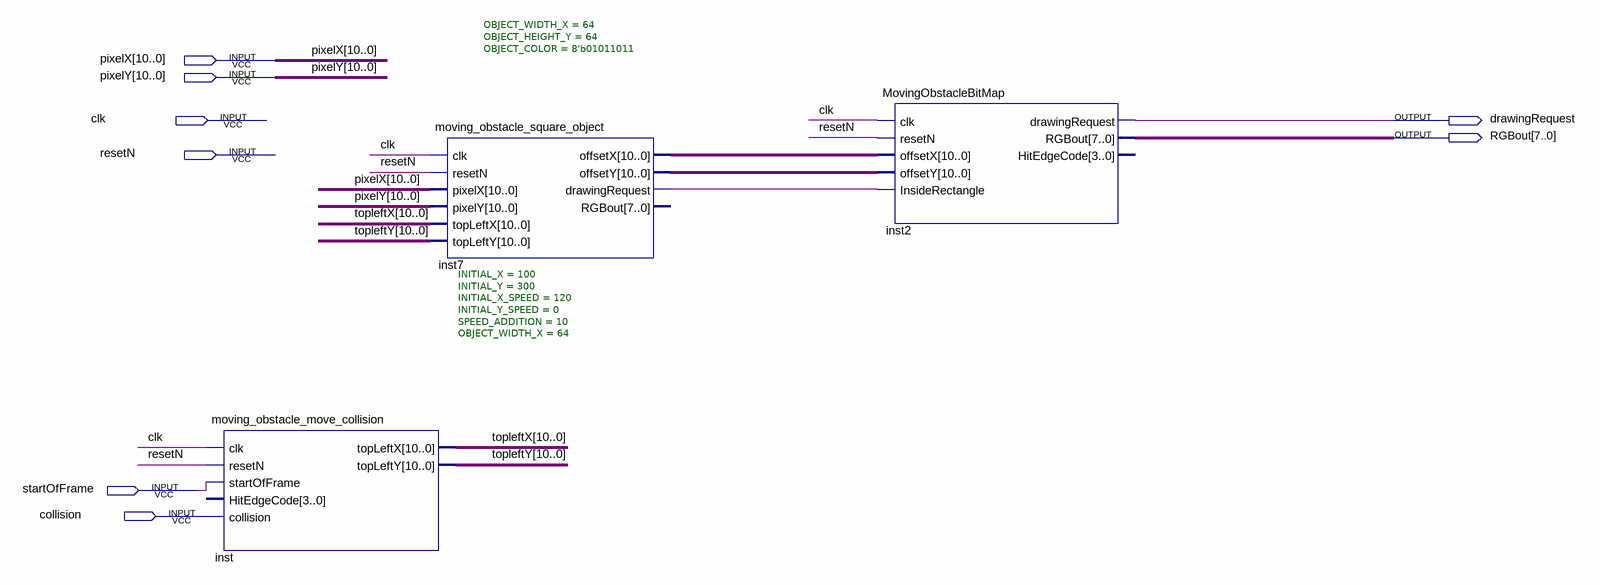
[diagram p0: schematic sheet]
// Quartus schematic moving_obstacle_block.bdf as structural Verilog: 3 symbols, 8 pins
module moving_obstacle_block (
  input  [10:0] pixelX,
  input  [10:0] pixelY,
  input  clk,
  input  resetN,
  input  startOfFrame,
  input  collision,
  output drawingRequest,
  output [7:0] RGBout
);

  wire inst7_drawingrequest;
  wire [10:0] inst7_offsetx, inst7_offsety, topleftX, topleftY;

  moving_obstacle_move_collision #(.INITIAL_X(100), .INITIAL_Y(300), .INITIAL_X_SPEED(120), .INITIAL_Y_SPEED(0), .SPEED_ADDITION(10), .OBJECT_WIDTH_X(64)) inst (
    .clk(clk), .resetN(resetN), .startOfFrame(startOfFrame), .topLeftX(topleftX), .topLeftY(topleftY));  // open: HitEdgeCode, collision
  moving_obstacle_square_object #(.OBJECT_WIDTH_X(64), .OBJECT_HEIGHT_Y(64), .OBJECT_COLOR(8'b01011011)) inst7 (
    .clk(clk), .resetN(resetN), .pixelX(pixelX), .pixelY(pixelY), .topLeftX(topleftX), .topLeftY(topleftY),
    .offsetX(inst7_offsetx), .offsetY(inst7_offsety), .drawingRequest(inst7_drawingrequest));  // open: RGBout
  MovingObstacleBitMap inst2 (
    .clk(clk), .resetN(resetN), .offsetX(inst7_offsetx), .offsetY(inst7_offsety),
    .InsideRectangle(inst7_drawingrequest), .drawingRequest(drawingRequest), .RGBout(RGBout));  // open: HitEdgeCode
endmodule
